# EAGLE design mediator (EAGLE 5.11)
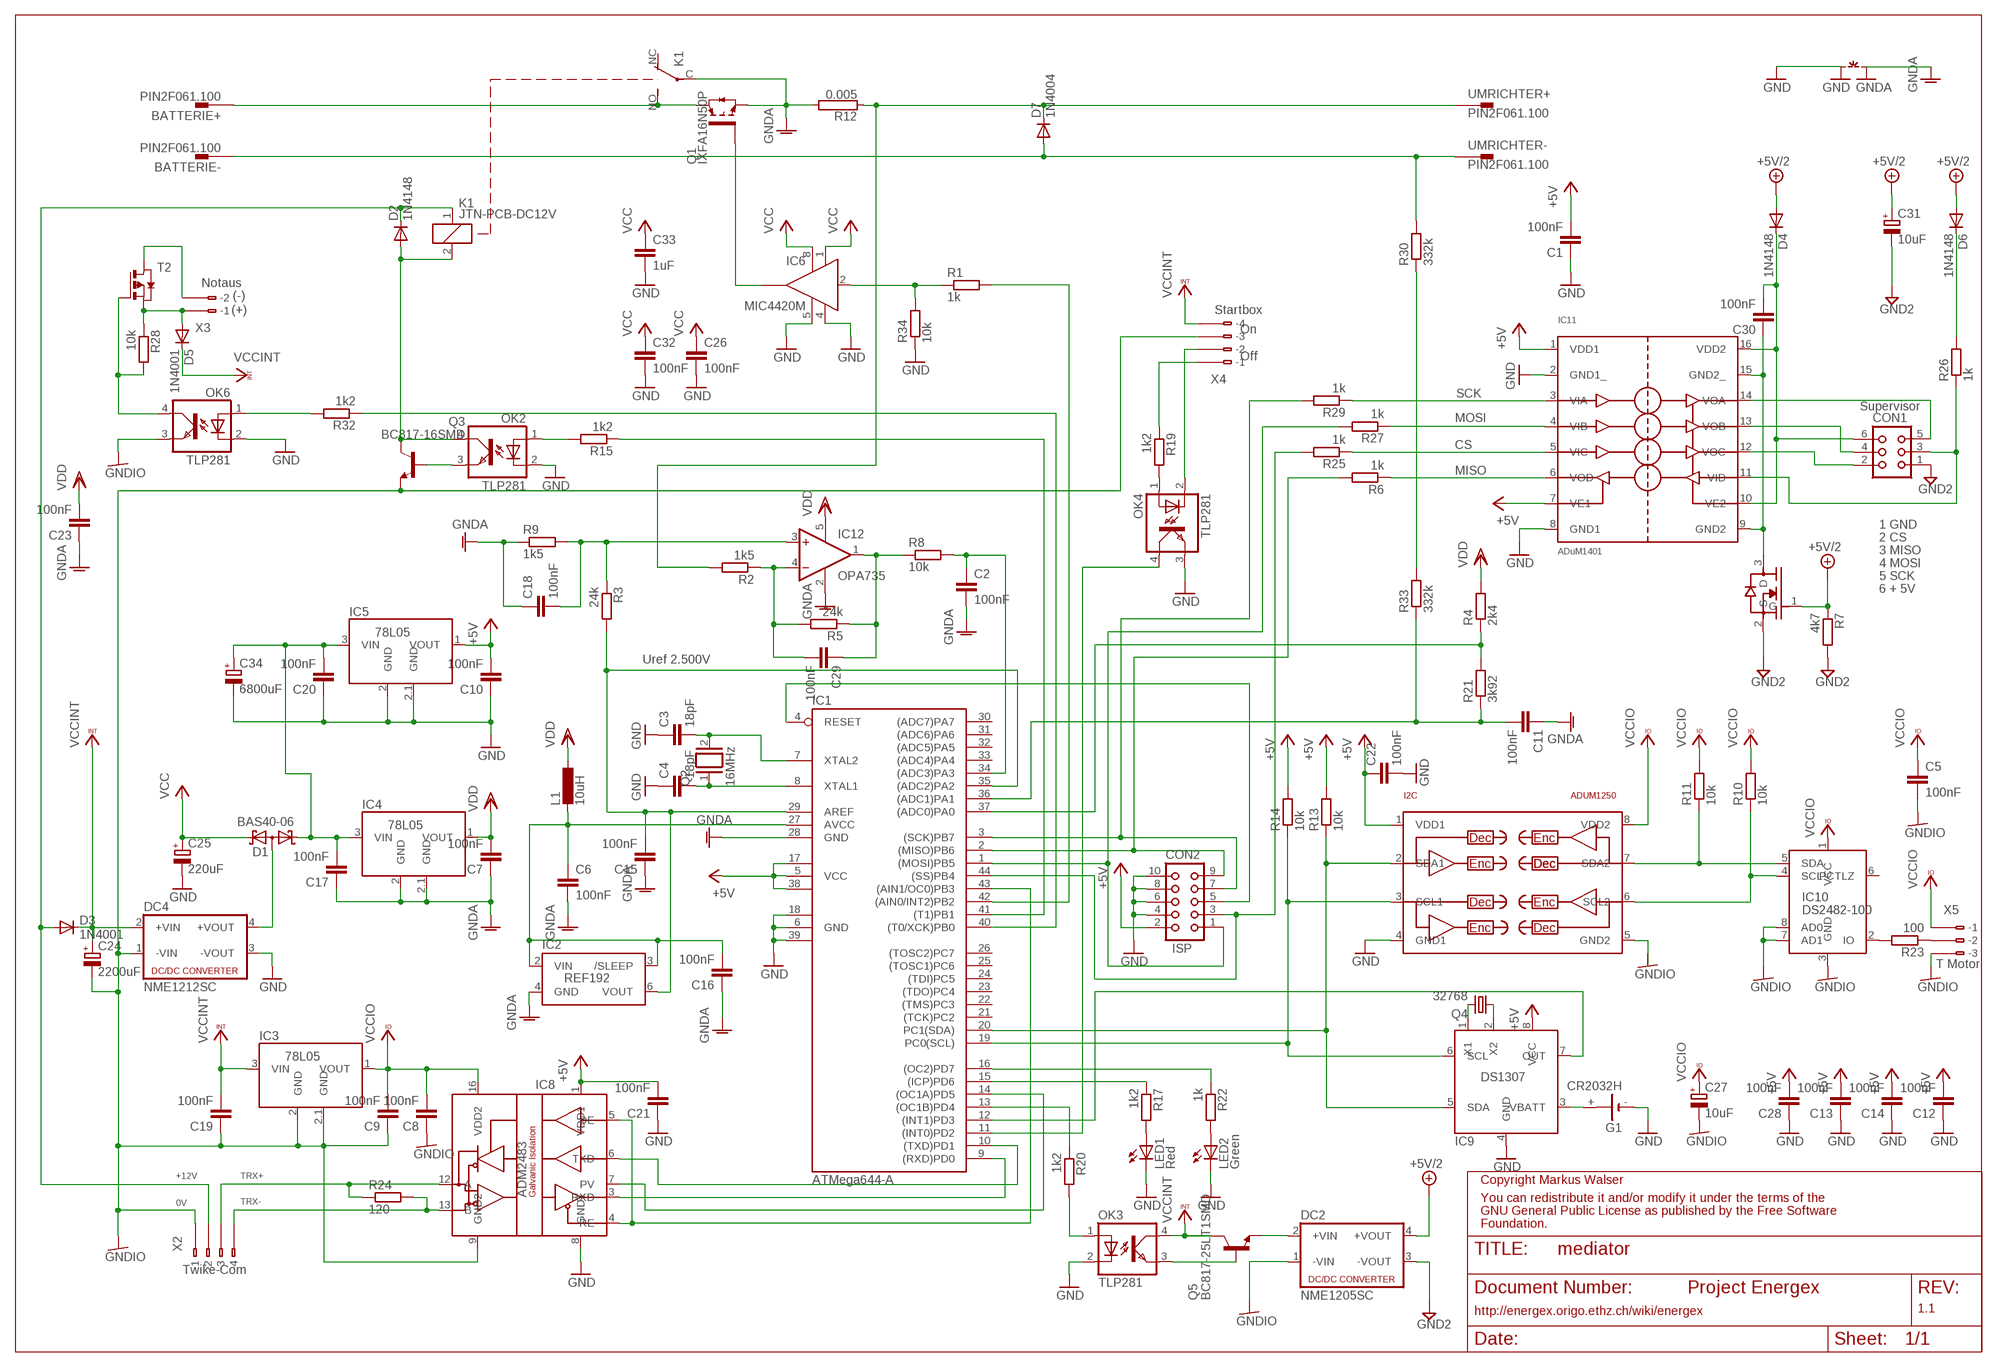
[diagram p0: schematic, sheet 1]

## Parts
BATTERIE+  PIN2F061.100  [F061.100]
BATTERIE-  PIN2F061.100  [F061.100]
C1  100nF  C-EUC0603K  [C0603K]
C2  100nF  C-EUC0603K  [C0603K]
C3  18pF  C-EUC0603K  [C0603K]
C4  18pF  C-EUC0603K  [C0603K]
C5  100nF  C-EUC0603K  [C0603K]
C6  100nF  C-EUC0603K  [C0603K]
C7  100nF  C-EUC0603K  [C0603K]
C8  100nF  C-EUC0603K  [C0603K]
C9  100nF  C-EUC0603K  [C0603K]
C10  100nF  C-EUC0603K  [C0603K]
C11  100nF  C-EUC0603K  [C0603K]
C12  100nF  C-EUC0603K  [C0603K]
C13  100nF  C-EUC0603K  [C0603K]
C14  100nF  C-EUC0603K  [C0603K]
C15  100nF  C-EUC0603K  [C0603K]
C16  100nF  C-EUC0603K  [C0603K]
C17  100nF  C-EUC0603K  [C0603K]
C18  100nF  C-EUC0603K  [C0603K]
C19  100nF  C-EUC0603K  [C0603K]
C20  100nF  C-EUC0603K  [C0603K]
C21  100nF  C-EUC0603K  [C0603K]
C22  100nF  C-EUC0603K  [C0603K]
C23  100nF  C-EUC0603K  [C0603K]
C24  2200uF  CPOL-EUE5-10.5  [E5-10,5]
C25  220uF  CPOL-EUE2.5-6  [E2,5-6]
C26  100nF  C-EUC0603K  [C0603K]
C27  10uF  CPOL-EUSMCA  [SMC_A]
C28  100nF  C-EUC0603K  [C0603K]
C29  100nF  C-EUC0603K  [C0603K]
C30  100nF  C-EUC0603K  [C0603K]
C31  10uF  CPOL-EUSMCA  [SMC_A]
C32  100nF  C-EUC0603K  [C0603K]
C33  1uF  C-EUC0603K  [C0603K]
C34  6800uF  CPOL-EUE7.5-16  [E7,5-16]
CON1  CON06  [CON06]
CON2  CON10  [CON10]
D1  BAS40-06  [SOT23]
D2  1N4148  DIODE-MICROMELF-R  [MICROMELF-R]
D3  1N4001  DIODE-DO214AC  [DO214AC]
D4  1N4148  DIODE-MICROMELF-R  [MICROMELF-R]
D5  1N4001  DIODE-DO214AC  [DO214AC]
D6  1N4148  DIODE-MICROMELF-R  [MICROMELF-R]
D7  1N4004  [DO41-10]
DC2  NME1205SC  NME  [NME]
DC4  NME1212SC  NME  [NME]
G1  CR2032H  [CR2032H]
I2C  ADUM1250  [SO8]
IC1  ATMega644-A  MEGA32-A  [TQFP44]
IC2  REF192  [SO08]
IC3  78L05  [SOT89]
IC4  78L05  [SOT89]
IC5  78L05  [SOT89]
IC6  MIC4420M  [SO-08]
IC8  ADM2483  [SO16W]
IC9  DS1307  [SO08]
IC10  DS2482-100  [SO08]
IC11  ADuM1401  ADUM1401  [SO16W]
IC12  OPA735  OPA743  [SOT23-5]
K1  JTN-PCB-DC12V  [JT-PCB]
L1  10uH  L-EUL3225M  [L3225M]
LED1  Red  LEDCHIPLED_0805  [CHIPLED_0805]
LED2  Green  LEDCHIPLED_0805  [CHIPLED_0805]
OK2  TLP281  TLP283  [MINI-FLAT-4]
OK3  TLP281  TLP283  [MINI-FLAT-4]
OK4  TLP281  TLP283  [MINI-FLAT-4]
OK6  TLP281  TLP283  [MINI-FLAT-4]
Q1  IXFA16N50P  IRG4BC15UD-S  [D2PACK]
Q2  16MHz  XTAL/S  [QS]
Q3  BC817-16SMD  [SOT23-BEC]
Q4  32768  CRYSTALTC26H  [TC26H]
Q5  BC817-25LT1SMD  [SOT23-BEC]
R1  1k  R-EU_R0603  [R0603]
R2  1k5  R-EU_M0805  [M0805]
R3  24k  R-EU_M0805  [M0805]
R4  2k4  R-EU_M0805  [M0805]
R5  24k  R-EU_M0805  [M0805]
R6  1k  R-EU_M0805  [M0805]
R7  4k7  R-EU_R0603  [R0603]
R8  10k  R-EU_M0805  [M0805]
R9  1k5  R-EU_M0805  [M0805]
R10  10k  R-EU_M0805  [M0805]
R11  10k  R-EU_M0805  [M0805]
R12  0.005  RKH208-8  [KH208-8]
R13  10k  R-EU_M0805  [M0805]
R14  10k  R-EU_M0805  [M0805]
R15  1k2  R-EU_R0603  [R0603]
R17  1k2  R-EU_R0603  [R0603]
R19  1k2  R-EU_R0603  [R0603]
R20  1k2  R-EU_R0603  [R0603]
R21  3k92  R-EU_M0805  [M0805]
R22  1k  R-EU_R0603  [R0603]
R23  100  R-EU_M0805  [M0805]
R24  120  R-EU_R0603  [R0603]
R25  1k  R-EU_M0805  [M0805]
R26  1k  R-EU_R0603  [R0603]
R27  1k  R-EU_M0805  [M0805]
R28  10k  R-EU_M0805  [M0805]
R29  1k  R-EU_M0805  [M0805]
R30  332k  R-EU_0207/10  [0207/10]
R32  1k2  R-EU_R0603  [R0603]
R33  332k  R-EU_0207/5V  [0207/5V]
R34  10k  R-EU_R0603  [R0603]
T1  FDN337N  [SOT23]
T2  PMOSSOT23  [SOT-23]
UMRICHTER+  PIN2F061.100  [F061.100]
UMRICHTER-  PIN2F061.100  [F061.100]
X2  233-104  [233-104]
X3  233-102  [233-102]
X4  233-104  [233-104]
X5  233-203  [233-203]
~NUDEV~1  GND-GNDA  [GND-GNDA]

## Nets
+5V: C1.2 C10.2 C12.2 C13.2 C14.2 C21.2 C22.1 C28.2 CON2.2 I2C.1(VDD1) IC1.5(VCC) IC1.17(VCC1) IC1.38(VCC2) IC5.1(VOUT) IC8.1(VDD1) IC9.8(VCC) IC11.1(VDD1) IC11.7(VE1) R13.2 R14.2
+5V/2: C31.+ D4.A D6.A DC2.4(+VOUT) R7.1 T1.1(G)
GND: C1.1 C3.1 C4.1 C10.1 C12.1 C13.1 C14.1 C20.1 C21.1 C22.2 C25.- C26.2 C28.1 C32.2 C33.2 C34.- CON2.4 CON2.6 CON2.8 CON2.10 DC4.3(-VOUT) G1.- I2C.4(GND1) IC1.6(GND) IC1.18(GND1) IC1.39(GND2) IC5.2(GND) IC5.2.1(GND) IC6.4(GND) IC6.5(GND1) IC8.8(GND1) IC9.4(GND) IC11.2(GND1_) IC11.8(GND1) LED1.C LED2.C OK2.2(C) OK3.2(C) OK4.3(EMIT) OK6.2(C) R34.1 ~NUDEV~1.GND
GND2: C31.- CON1.1 DC2.3(-VOUT) R7.2 T1.2(S)
GNDA: C2.2 C6.2 C7.1 C11.1 C15.1 C16.1 C17.1 C18.1 C23.1 IC1.28(GND) IC2.4(GND) IC4.2(GND) IC4.2.1(GND) IC12.2(V-) K1.C(P) Q1.3(E) R9.1 R12.2 ~NUDEV~1.GNDA
GNDIO: C5.2 C8.1 C9.1 C19.1 C24.- C27.- DC2.1(-VIN) DC4.1(-VIN) I2C.5(GND2) IC3.2(GND) IC3.2.1(GND) IC8.9(GND2) IC10.3(GND) IC10.7(AD1) IC10.8(AD0) OK6.3(EMIT) Q3.E X2.B1(B-1) X4.B3(B-3) X5.B3(B-3)
N$1: IC6.6(OUT) Q1.1(G)
N$2: BATTERIE+.A1 K1.NO(S) Q1.2(C)
N$3: IC9.1(X1) Q4.2
N$4: CON2.7 IC1.3((SCK)PB7) R29.2
N$5: C18.2 IC12.3(+IN) R3.1 R9.2
N$6: C29.2 IC12.4(-IN) R2.1 R5.2
N$7: C29.1 IC12.1(OUT) R5.1 R8.1
N$8: CON2.1 IC1.1((MOSI)PB5) R27.2
N$9: DC2.2(+VIN) Q5.E
N$10: CON2.3 IC1.44((SS)PB4) R25.2
N$11: C2.1 IC1.34((ADC3)PA3) R8.2
N$12: C3.2 IC1.7(XTAL2) Q2.2
N$13: C4.2 IC1.8(XTAL1) Q2.1
N$14: I2C.6(SCL2) IC10.4(SCL) R10.1
N$15: I2C.7(SDA2) IC10.5(SDA) R11.1
N$16: D7.C R2.2 R12.1 UMRICHTER+.A1
N$17: IC10.2(IO) R23.2
N$18: BATTERIE-.A1 D7.A R30.2 UMRICHTER-.A1
N$19: IC1.37((ADC0)PA0) R4.1 R21.2
N$20: OK2.3(EMIT) Q3.B
N$21: OK2.1(A) R15.2
N$22: C6.1 C16.2 IC1.27(AVCC) IC2.2(VIN) IC2.3(/SLEEP) L1.2
N$23: I2C.2(SDA1) IC1.20(PC1(SDA)) IC9.5(SDA) R13.1
N$24: I2C.3(SCL1) IC1.19(PC0(SCL)) IC9.6(SCL) R14.1
N$25: IC1.41((T1)PB1) R15.1
N$26: D2.C D3.A K1.1 X2.B2(B-2)
N$27: IC1.15((ICP)PD6) R17.1
N$28: D2.A K1.2 OK2.4(COL) Q3.C
N$29: IC1.9((RXD)PD0) IC8.3(RXD)
N$30: CON2.9 IC1.2((MISO)PB6) R6.2
N$31: IC1.42((AIN0/INT2)PB2) R1.2
N$32: IC11.6(VOD) R6.1
N$33: D5.A R28.1 T2.2(S) X3.B1(B-1)
N$34: IC1.10((TXD)PD1) IC8.6(TXD)
N$35: CON1.2 IC11.12(VOC)
N$36: IC8.13(B) R24.2 X2.B4(B-4)
N$37: IC1.16((OC2)PD7) R22.1
N$38: IC8.12(A) R24.1 X2.B3(B-3)
N$39: IC1.43((AIN1/OC0)PB3) IC8.4(RE) IC8.5(DE)
N$40: IC1.14((OC1A)PD5) IC8.7(PV)
N$41: R23.1 X5.B2(B-2)
N$42: R30.1 R33.2
N$43: T2.1(D) X3.B2(B-2)
N$44: C30.1 IC11.9(GND2) IC11.15(GND2_) T1.3(D)
N$45: OK3.3(EMIT) Q5.B
N$46: OK3.1(A) R20.2
N$47: IC1.13((OC1B)PD4) R20.1
N$48: IC1.11((INT0)PD2) OK4.4(COL)
N$49: OK4.2(C) X4.B2(B-2)
N$50: OK4.1(A) R19.2
N$51: G1.+ IC9.3(VBATT)
N$52: CON1.3 IC11.11(VID) R26.1
N$53: CON1.4 IC11.13(VOB)
N$54: CON2.5 IC1.4(RESET)
N$55: CON1.5 IC11.14(VOA)
N$57: LED1.A R17.2
N$58: R19.1 X4.B1(B-1)
N$59: C15.2 IC1.29(AREF) IC1.35((ADC2)PA2) IC2.6(VOUT) R3.2
N$60: IC1.12((INT1)PD3) IC9.7(OUT)
N$61: C30.2 CON1.6 D4.C IC11.10(VE2) IC11.16(VDD2)
N$62: C17.2 C20.2 C34.+ D1.1(K1) IC4.3(VIN) IC5.3(VIN)
N$63: IC9.2(X2) Q4.1
N$64: LED2.A R22.2
N$65: IC6.2(IN) R1.1 R34.2
N$66: D1.3(AA) DC4.4(+VOUT)
N$67: C11.2 IC1.36((ADC1)PA1) R21.1 R33.1
N$69: D6.C R26.2
N$70: IC11.5(VIC) R25.1
N$71: IC11.4(VIB) R27.1
N$72: IC11.3(VIA) R29.1
N$73: OK6.4(COL) R28.2 T2.3(G)
N$74: OK6.1(A) R32.2
N$76: IC1.40((T0/XCK)PB0) R32.1
VCC: C25.+ C26.1 C32.1 C33.1 D1.2(K2) IC6.1(VS) IC6.8(VS1)
VCCINT: C19.2 C24.+ D3.C D5.C DC4.2(+VIN) IC3.3(VIN) OK3.4(COL) Q5.C X4.B4(B-4)
VCCIO: C5.1 C8.2 C9.2 C27.+ I2C.8(VDD2) IC3.1(VOUT) IC8.16(VDD2) IC10.1(VCC) R10.2 R11.2 X5.B1(B-1)
VDD: C7.2 C23.2 IC4.1(VOUT) IC12.5(V+) L1.1 R4.2
Unconnected: BATTERIE+.A2(1.1) BATTERIE-.A2(1.1) G1.+@1(+) IC1.21((TCK)PC2) IC1.22((TMS)PC3) IC1.23((TDO)PC4) IC1.24((TDI)PC5) IC1.25((TOSC1)PC6) IC1.26((TOSC2)PC7) IC1.30((ADC7)PA7) IC1.31((ADC6)PA6) IC1.32((ADC5)PA5) IC1.33((ADC4)PA4) IC6.7(OUT) IC10.6(PCTLZ) K1.NC(O) UMRICHTER+.A2(1.1) UMRICHTER-.A2(1.1) X2.A1(-1) X2.A2(-2) X2.A3(-3) X2.A4(-4) X3.A1(-1) X3.A2(-2) X4.A1(-1) X4.A2(-2) X4.A3(-3) X4.A4(-4) X5.A1(-1) X5.A2(-2) X5.A3(-3)

## Notes on the sheet
- Notaus
- (-)
- (+) | Startbox
- On
- Off
- SCK
- Supervisor
- MOSI
- CS
- MISO
- 1 GND
- 2 CS
- 3 MISO
- 4 MOSI
- 5 SCK
- 6 + 5V
- Uref 2.500V
- ISP
- T Motor
- +12V | TRX+
- Copyright Markus Walser
- TRX- | You can redistribute it and/or modify it under the terms of the
- 0V
- GNU General Public License as published by the Free Software
- Foundation.
- Twike-Com
- Project Energex
- http://energex.origo.ethz.ch/wiki/energex | 1.1

## Library data of the parts
BATTERIE+ BATTERIE- UMRICHTER+ UMRICHTER- = con-faston:PIN2: Flachstecker Typ Tyco/Electronics/AMP TAB, FASTON Printed Circuit Board Tabs Source: http://www.buerklin.com, http://catalog.tycoelectronics.com; OC_FARNELL: unknown; OC_NEWARK: unknown
C1-C23 C26 C28-C30 C32 C33 = rcl:C-EU: CAPACITOR, European symbol
C24 C25 C27 C31 C34 = rcl:CPOL-EU: POLARIZED CAPACITOR, European symbol
CON1 = con-harting:CON06: CONNECTOR; OC_FARNELL: unknown; OC_NEWARK: unknown
CON2 = con-harting:CON10: CONNECTOR; OC_FARNELL: unknown; OC_NEWARK: unknown
D1 = diode:BAS40-06: Silicon Schottky Diodes General-purpose diode for high-speed switching
D2-D6 = diode:DIODE-: DIODE
D7 = diode:1N4004: DIODE general purpose rectifier, 1 A
DC2 DC4 = dc-dc-converter:NME: DC-DC CONVERTER; MF: C & D TECHNOLOGIES, INC; MPN: NME1205D; OC_FARNELL: 1021466; OC_NEWARK: 98B8198
G1 = mediator:CR2032H: LI BATTERY Varta
I2C = analog-devices:ADUM1250
IC1 = atmel:MEGA32: MICROCONTROLLER 32 Kbytes FLASH 2 Kbytes SRAM 1 Kbytes EEPROM USART 8-channel 10 bit ADC Source: www.atmel.com .. doc2503.pdf; MPN: ATMEGA32-16AU; OC_FARNELL: 9171274; OC_NEWARK: 69K6677
IC2 = icontroller:REF192
IC3-IC5 = icontroller:78L05: Negative voltage regulators
IC6 = transistor-power:MIC4420: 6A-Peak Low-Side MOSFET Driver Bipolar/CMOS/DMOS Process http://www.micrel.com/_PDF/mic4420.pdf
IC8 = icontroller:ADM2483: RS-485 Transceiver, iCoupler® Isolated, Half-Duplex
IC9 = icontroller:DS1307: 64 x 8, Serial, I2C Real-Time Clock
IC10 = icontroller:DS2482-100: Single-Channel 1-Wire Master
IC11 = spisolator:ADUM1401: Quad-Channel Digital Isolators The ADuM1401 is a 3/1 quad-channel digital isolators based on Analog Devices, Inc., iCoupler® technology. Combining high speed CMOS and monolithic air core transformer technology, these isolation components provide outstanding performance characteristics superior to alternatives, such as optocoupler devices.
IC12 = linear:OPA743: 12V, 7MHz, CMOS, Rail-to-Rail I/O OP AMP Source: http://focus.ti.com/lit/ds/sbos201/sbos201.pdf
K1 = relay:JT?-*: COMPACT ECONOMICAL 30 AMP. RELAY NAiS Source: http://www.mew-europe.com/.. en_ds_61212_0000.pdf; OC_FARNELL: unknown; OC_NEWARK: unknown
L1 = rcl:L-EU: INDUCTOR, European symbol
LED1 LED2 = led:LED: LED OSRAM: - CHIPLED LG R971, LG N971, LY N971, LG Q971, LY Q971, LO R971, LY R971 LH N974, LH R974 LS Q976, LO Q976, LY Q976 LO Q996 - Hyper CHIPLED LW Q18S LB Q993, LB Q99A, LB R99A - SideLED LS A670, LO A670, LY A670, LG A670, LP A670 LB A673, LV A673, LT A673, LW A673 LH A674 LY A675 LS A676, LA A676, LO A676, LY A676, LW A676 LS A679, LY A679, LG A679 - Hyper Micro SIDELED® LS Y876, LA Y876, LO Y876, LY Y876 LT Y87S - SmartLED LW L88C, LW L88S LB L89C, LB L89S, LG L890 LS L89K, LO L89K, LY L89K LS L896, LA L896, LO L896, LY L896 - TOPLED LS T670, LO T670, LY T670, LG T670, LP T670 LSG T670, LSP T670, LSY T670, LOP T670, LYG T670 LG T671, LOG T671, LSG T671 LB T673, LV T673, LT T673, LW T673 LH T674 LS T676, LA T676, LO T676, LY T676, LB T676, LH T676, LSB T676, LW T676 LB T67C, LV T67C, LT T67C, LS T67K, LO T67K, LY T67K, LW E67C LS E67B, LA E67B, LO E67B, LY E67B, LB E67C, LV E67C, LT E67C LW T67C LS T679, LY T679, LG T679 LS T770, LO T770, LY T770, LG T770, LP T770 LB T773, LV T773, LT T773, LW T773 LH T774 LS E675, LA E675, LY E675, LS T675 LS T776, LA T776, LO T776, LY T776, LB T776 LHGB T686 LT T68C, LB T68C - Hyper Mini TOPLED® LB M676 - Mini TOPLED Santana® LG M470 LS M47K, LO M47K, LY M47K Source: http://www.osram.convergy.de LUXEON: - LUMILED® LXK2-PW12-R00, LXK2-PW12-S00, LXK2-PW14-U00, LXK2-PW14-V00 LXK2-PM12-R00, LXK2-PM12-S00, LXK2-PM14-U00 LXK2-PE12-Q00, LXK2-PE12-R00, LXK2-PE12-S00, LXK2-PE14-T00, LXK2-PE14-U00 LXK2-PB12-K00, LXK2-PB12-L00, LXK2-PB12-M00, LXK2-PB14-N00, LXK2-PB14-P00, LXK2-PB14-Q00 LXK2-PR12-L00, LXK2-PR12-M00, LXK2-PR14-Q00, LXK2-PR14-R00 LXK2-PD12-Q00, LXK2-PD12-R00, LXK2-PD12-S00 LXK2-PH12-R00, LXK2-PH12-S00 LXK2-PL12-P00, LXK2-PL12-Q00, LXK2-PL12-R00 Source: www.luxeon.com KINGBRIGHT: KA-3528ASYC Source: www.kingbright.com
OK2-OK4 OK6 = optocoupler:TLP283: TOSHIBA PHOTOCOUPLER GaAs IRED & PHOTO-TRANSISTOR Source: http://www.semicon.toshiba.co.jp/td/en/Opto/Photocoupler/en_20050928_TLP283_datasheet.pdf; OC_FARNELL: unknown; OC_NEWARK: unknown
Q1 = transistor-power:IRG4BC15UD-: INSULATED GATE BIPOLAR TRANSISTOR WITH ULTRAFAST SOFT RECOVERY DIODE
Q2 = special:XTAL/S: CRYSTAL
Q3 Q5 = transistor-npn:BC817*: NPN Transistor
Q4 = crystal:CRYSTAL: CRYSTAL; OC_FARNELL: unknown; OC_NEWARK: unknown
R1-R11 R13-R15 R17 R19-R30 R32-R34 = rcl:R-EU_: RESISTOR, European symbol
R12 = resistor-power:R: Power Resitor; OC_FARNELL: unknown; OC_NEWARK: unknown
T1 = supervisor:FDN337N: N-Channel Logic Level Enhancement Mode Field Effect Transistor
T2 = zetex:PMOSSOT23: MOS FET; OC_FARNELL: unknown; OC_NEWARK: unknown
X2 X4 = con-wago:233-104: WAGO Cage Clamp; MPN: 233-104; OC_FARNELL: unknown; OC_NEWARK: 28K9046
X3 = con-wago:233-102: WAGO Cage Clamp; MPN: 233-102; OC_FARNELL: unknown; OC_NEWARK: 28K9044
X5 = con-wago:233-203: WAGO Cage Clamp; MPN: 233-203; OC_FARNELL: 1283533; OC_NEWARK: 28K9060
~NUDEV~1 = supply1:GND-GNDA: Example of GND--GNDA NET-Connetor for more info see description in package

## Board
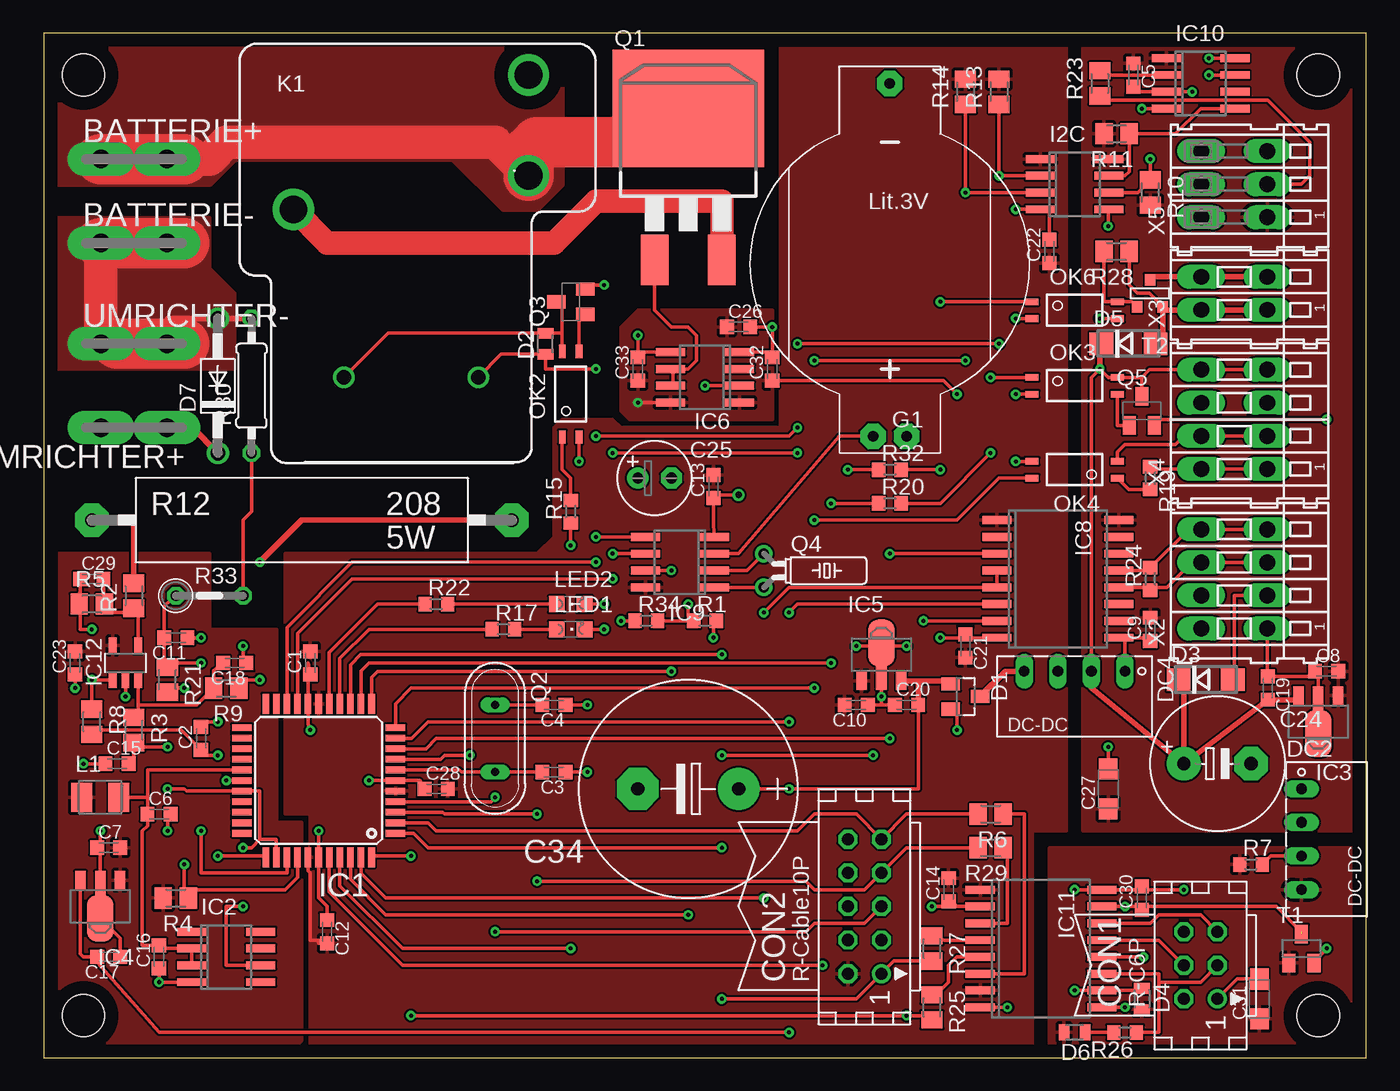
[diagram p1: board, top side]
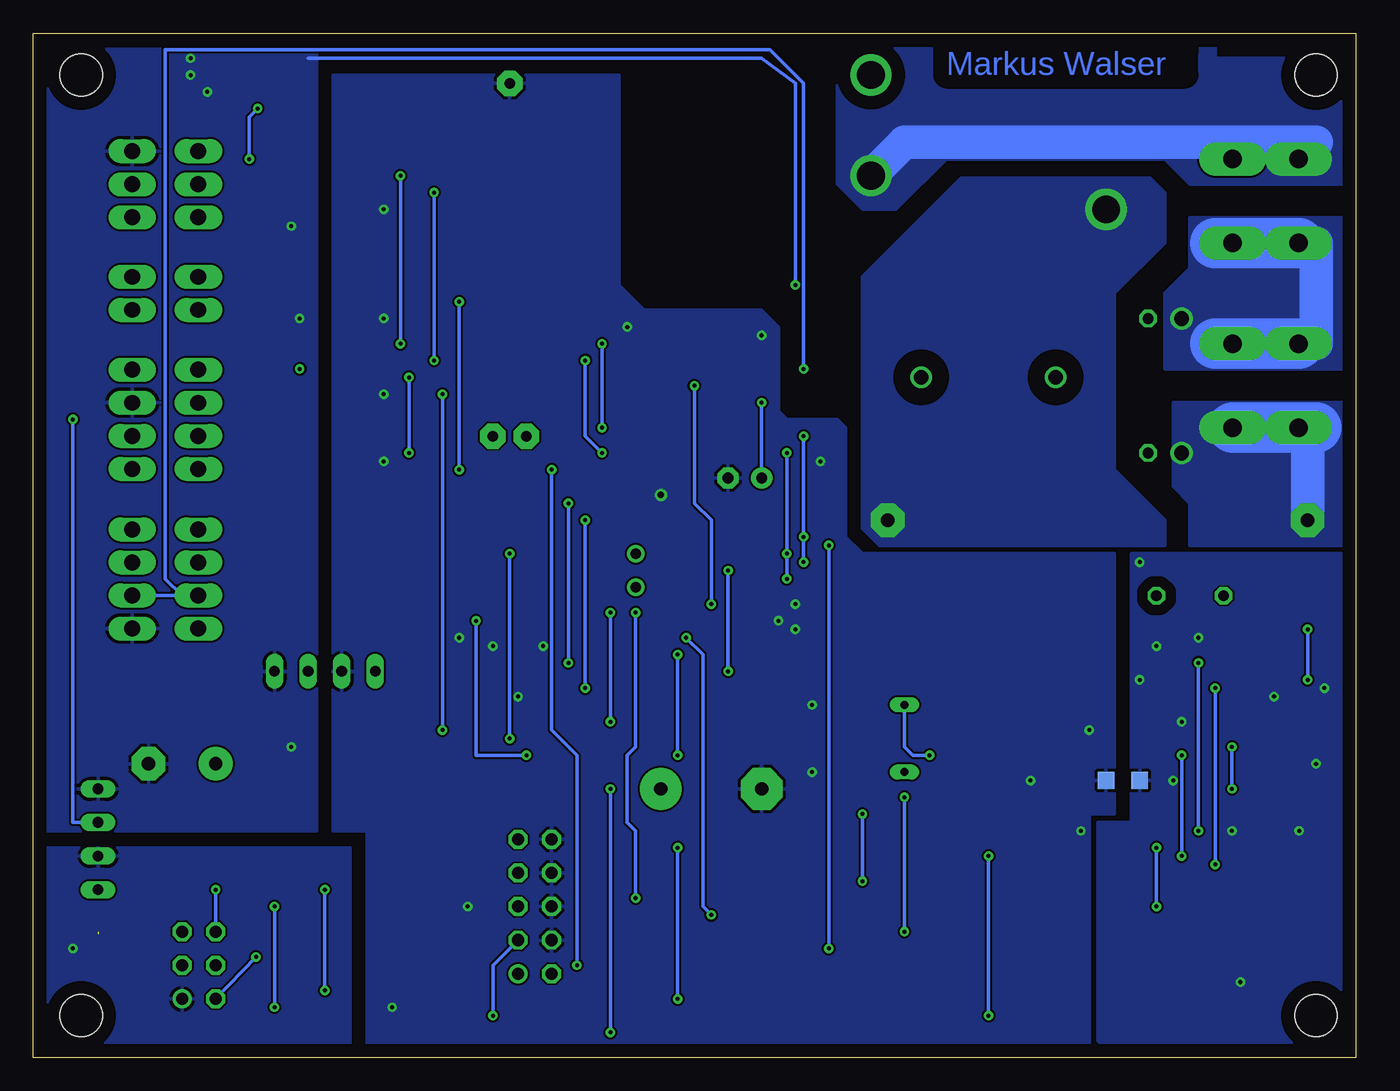
[diagram p2: board, bottom side, seen from below]

Size 100 x 77.46 mm. Coordinates in mm from the lower left corner, seen from the top.
Outline: 0,0 100,0 100,77.46 0,77.46 0,0
Copper layers (1*16): Top 0.035mm / dielectric 1.5mm / Bottom 0.035mm
Design rules "default *": minimum track width 6mil, minimum drill 12mil, track to track 6mil, track to pad 6mil, pad to pad 6mil, via to via 6mil, smd to smd 6mil, copper to edge 40mil, drill to drill 8mil, minimum pad ring 10mil, minimum via ring 8mil, stop-mask expansion 4mil, vias tented up to drill 25mil, thermal gap 10mil
Holes 3.2 mm at 96.36,3.17 3.01,3.17 96.36,74.29 3.01,74.29

### Footprints (pad centres in the part's own frame; a part is rotated, then mirrored left to right if it is on the bottom)
F061.100 = drill 1.4 pad 2.54 long: A1 -2.5,0; A2 2.5,0
C0603K = smd 1.05 x 1.08: 1 -0.875,0; 2 0.875,0
E5-10,5 = drill 1.016 pad 2.54: + -2.54,0 | drill 1.016 pad 2.54 octagon: - 2.54,0
E2,5-6 = drill 0.813 pad 1.6: + -1.27,0 | drill 0.813 pad 1.6 octagon: - 1.27,0
SMC_A = smd 1.6 x 1.4: + -1.5,0; - 1.5,0
E7,5-16 = drill 1.016 pad 3.15: + -3.81,0 | drill 1.016 pad 3.15 octagon: - 3.81,0
CON06 = drill 0.914: 1 -2.54,-1.27 | drill 0.914 octagon: 2 -2.54,1.27; 3 0,-1.27; 4 0,1.27; 5 2.54,-1.27; 6 2.54,1.27
CON10 = drill 0.914: 1 -5.08,-1.27 | drill 0.914 octagon: 2 -5.08,1.27; 3 -2.54,-1.27; 4 -2.54,1.27; 5 0,-1.27; 6 0,1.27; 7 2.54,-1.27; 8 2.54,1.27; 9 5.08,-1.27; 10 5.08,1.27
SOT23 = smd 1 x 1.4: 1 -0.95,-1.1; 2 0.95,-1.1; 3 0,1.1
MICROMELF-R = smd 0.8 x 1.2: A 0.8,0; C -0.8,0
DO214AC = smd 1.8 x 1.7: A 2.05,0; C -2.05,0
DO41-10 = drill 1.118: A 5.08,0; C -5.08,0
NME = drill 0.813 long: 1 0,3.81; 2 0,1.27; 3 0,-1.27; 4 0,-3.81
CR2032H = drill 0.8 pad 1.93 octagon: + 1.27,13.335; +@1 -1.27,13.335; - 0,-13.335
SO8@1 = smd 0.6 x 2.2: 1 -1.905,-2.6; 2 -0.635,-2.6; 3 0.635,-2.6; 4 1.905,-2.6; 5 1.905,2.6; 6 0.635,2.6; 7 -0.635,2.6; 8 -1.905,2.6
TQFP44 = smd 1.5 x 0.5: 1 -5.8,4; 2 -5.8,3.2; 3 -5.8,2.4; 4 -5.8,1.6; 5 -5.8,0.8; 6 -5.8,0; 7 -5.8,-0.8; 8 -5.8,-1.6; 9 -5.8,-2.4; 10 -5.8,-3.2; 11 -5.8,-4; 23 5.8,-4; 24 5.8,-3.2; 25 5.8,-2.4; 26 5.8,-1.6; 27 5.8,-0.8; 28 5.8,0; 29 5.8,0.8; 30 5.8,1.6; 31 5.8,2.4; 32 5.8,3.2; 33 5.8,4 | smd 0.5 x 1.5: 12 -4,-5.8; 13 -3.2,-5.8; 14 -2.4,-5.8; 15 -1.6,-5.8; 16 -0.8,-5.8; 17 0,-5.8; 18 0.8,-5.8; 19 1.6,-5.8; 20 2.4,-5.8; 21 3.2,-5.8; 22 4,-5.8; 34 4,5.8; 35 3.2,5.8; 36 2.4,5.8; 37 1.6,5.8; 38 0.8,5.8; 39 0,5.8; 40 -0.8,5.8; 41 -1.6,5.8; 42 -2.4,5.8; 43 -3.2,5.8; 44 -4,5.8
SO08 = smd 0.6 x 2.2: 1 -1.905,-2.6; 2 -0.635,-2.6; 3 0.635,-2.6; 4 1.905,-2.6; 5 1.905,2.6; 6 0.635,2.6; 7 -0.635,2.6; 8 -1.905,2.6
SOT89 = smd 0.8 x 1.4: 1 -1.499,-1.981; 3 1.499,-1.981 | smd 0.8 x 1.9: 2 0,-1.727 | smd 2 x 3.5: 2.1 0,0.889
SO-08 = smd 0.6 x 2.2: 1 -1.905,-2.6; 2 -0.635,-2.6; 3 0.635,-2.6; 4 1.905,-2.6; 5 1.905,2.6; 6 0.635,2.6; 7 -0.635,2.6; 8 -1.905,2.6
SO16W = smd 0.6 x 2.2: 1 -4.445,-4.6; 2 -3.175,-4.6; 3 -1.905,-4.6; 4 -0.635,-4.6; 5 0.635,-4.6; 6 1.905,-4.6; 7 3.175,-4.6; 8 4.445,-4.6; 9 4.445,4.6; 10 3.175,4.6; 11 1.905,4.6; 12 0.635,4.6; 13 -0.635,4.6; 14 -1.905,4.6; 15 -3.175,4.6; 16 -4.445,4.6
SOT23-5 = smd 0.6 x 1.2: 1 -0.95,-1.306; 2 0,-1.306; 3 0.95,-1.306; 4 0.95,1.306; 5 -0.95,1.306
JT-PCB = drill 1.1: 1 5.08,0; 2 -5.08,0 | drill 2.1: C -8.89,12.7; NC 8.89,22.86; NO 8.89,15.24
L3225M = smd 1.6 x 2.2: 1 -1.4,0; 2 1.4,0
CHIPLED_0805 = smd 1.2 x 1.2: A 0,-1.05; C 0,1.05
MINI-FLAT-4 = smd 1 x 0.5: 1 -3.24,0.635; 2 -3.24,-0.635; 3 3.24,-0.635; 4 3.24,0.635
D2PACK = smd 2.083 x 3.81: 1 -2.54,-8.89; 3 2.54,-8.89 | smd 11.43 x 8.89: 2 0,2.54
QS = drill 0.61 long: 1 -2.54,0; 2 2.54,0
SOT23-BEC = smd 1 x 1.4: B -0.95,-1.1; C 0,1.1; E 0.95,-1.1
TC26H = drill 0.813: 1 -1.27,0; 2 1.27,0
R0603 = smd 1 x 1.1: 1 -0.85,0; 2 0.85,0
M0805 = smd 1.3 x 1.6: 1 -0.95,0; 2 0.95,0
KH208-8 = drill 1.016 pad 2.54 octagon: 1 -15.875,0; 2 15.875,0
0207/10 = drill 0.813 octagon: 1 -5.08,0; 2 5.08,0
0207/5V = drill 0.813 octagon: 1 -2.54,0; 2 2.54,0
SOT-23 = smd 0.787 x 0.889: 1 0.025,-1.016; 2 -0.94,1.016; 3 0.991,1.016
233-104 = drill 1.2 long: A1 -3.75,2.5; A2 -1.25,2.5; A3 1.25,2.5; A4 3.75,2.5; B1 -3.75,-2.5; B2 -1.25,-2.5; B3 1.25,-2.5; B4 3.75,-2.5
233-102 = drill 1.2 long: A1 -1.25,2.5; A2 1.25,2.5; B1 -1.25,-2.5; B2 1.25,-2.5
233-203 = drill 1.2 long: A1 -2.5,2.5; A2 0,2.5; A3 2.5,2.5; B1 -2.5,-2.5; B2 0,-2.5; B3 2.5,-2.5
GND-GNDA = smd 1.27 x 1.27: GND -1.27,0; GNDA 1.27,0

### Placement (x,y rotation side)
BATTERIE+  6.82,67.94 0 top
BATTERIE-  6.82,61.59 0 top
C1  20.15,29.84 90 top
C2  11.9,24.12 90 top
C3  38.57,21.58 180 top
C4  38.57,26.66 180 top
C5  82.39,74.29 270 top
C6  8.73,18.41 0 top
C7  4.92,15.87 0 top
C8  96.99,29.2 0 top
C9  83.66,32.38 90 top
C10  61.43,26.66 180 top
C11  10,31.74 180 top
C12  21.42,9.52 270 top
C13  50.63,43.18 90 top
C14  68.41,12.7 90 top
C15  5.55,22.22 0 top
C16  8.73,7.62 90 top
C17  4.92,7.62 180 top
C18  14.44,29.84 180 top
C19  92.55,27.93 270 top
C20  65.24,26.66 0 top
C21  69.69,31.11 270 top
C22  76.03,60.96 90 top
C23  2.38,29.84 90 top
C24  88.73,22.22 0 top
C25  46.19,43.81 0 top
C26  52.54,55.24 0 top
C27  80.48,20.31 90 top
C28  29.68,20.31 0 top
C29  3.64,36.19 0 top
C30  83.02,12.06 90 top
C31  91.91,4.44 90 top
C32  55.08,52.07 90 top
C33  44.92,52.07 90 top
C34  48.73,20.31 180 top
CON1  87.47,6.98 90 top
CON2  62.06,11.43 90 top
D1  69.69,27.3 270 top
D2  37.94,53.97 90 top
D3  87.85,28.57 0 top
D4  83.02,4.44 270 top
D5  82,53.97 0 top
D6  77.94,1.9 180 top
D7  13.17,50.8 90 top
DC2  95.08,16.5 0 top
DC4  77.94,29.2 270 top
G1  63.97,60.32 180 top
I2C  ADUM1250  [SO8@1]  77.94,66.03 270 top
IC1  20.79,20.95 180 top
IC2  13.81,7.62 270 top
IC3  96.36,25.39 180 top
IC4  4.28,11.43 180 top
IC5  63.34,30.47 0 top
IC6  50,51.43 90 top
IC8  76.67,36.19 270 top
IC9  48.09,37.46 90 top
IC10  87.47,73.66 270 top
IC11  75.4,8.25 270 top
IC12  6.18,29.84 0 top
K1  27.77,51.43 0 top
L1  4.28,19.68 0 top
LED1  39.84,32.38 270 top
LED2  39.84,34.29 270 top
OK2  39.84,50.16 90 top
OK3  77.94,50.8 0 top
OK4  77.94,44.45 180 top
OK6  77.94,56.51 0 top
Q1  STB25NM50N  [D2PACK]  48.73,69.21 0 top
Q2  34.12,24.12 270 top
Q3  39.84,57.15 90 top
Q4  54.45,36.83 270 top
Q5  83.02,48.89 0 top
R1  50,33.02 0 top
R2  6.82,34.92 90 top
R3  6.82,24.76 270 top
R4  10,12.06 180 top
R5  3.64,34.29 0 top
R6  71.59,18.41 180 top
R7  91.28,14.6 0 top
R8  3.64,25.39 270 top
R9  13.81,27.93 180 top
R10  83.66,65.4 270 top
R11  81.11,69.84 180 top
R12  19.52,40.64 0 top
R13  72.22,73.02 90 top
R14  69.69,73.02 90 top
R15  39.84,41.27 90 top
R17  34.76,32.38 0 top
R19  83.66,43.81 270 top
R20  63.97,41.91 0 top
R21  9.36,28.57 270 top
R22  29.68,34.29 0 top
R23  79.84,73.66 90 top
R24  83.66,36.19 90 top
R25  67.14,3.8 270 top
R26  81.75,1.9 180 top
R27  67.14,8.25 270 top
R28  81.11,60.96 180 top
R29  71.59,15.87 180 top
R30  15.71,50.8 90 top
R32  63.97,44.45 0 top
R33  12.54,34.92 0 top
R34  45.55,33.02 0 top
T1  95.08,8.25 0 top
T2  83.66,57.78 180 top
UMRICHTER+  6.82,47.62 180 top
UMRICHTER-  6.82,53.97 0 top
X2  90,36.19 90 top
X3  90,57.78 90 top
X4  90,48.26 90 top
X5  90,66.03 90 top
~NUDEV~1  17.61,20.95 0 bottom

### Tracks (layer width: path | path; a pad name or v marks a point on that pad's centre or on a via)
+5V
  Top 0.254: C12.2 20.79,8.65 20.79,8.89 20.15,8.89 20.15,13.97 19.99,14.13 IC1.38
  pour Top: 77.3,76.83 55.71,76.83 55.71,47.62 43.65,47.62 43.02,48.26 39.2,48.26 38.57,47.62 38.57,39.37 37.3,38.1 18.25,38.1 18.25,18.41 20.15,18.41 20.15,0.63 74.77,0.63 74.77,17.14 77.3,17.14
+5V/2
  pour Top: 76.03,15.87 99.53,15.87 99.53,1.9 98.26,0.63 76.03,0.63
GND  (via drill 0.3, 0.5)
  Top 0.254: C1.1 19.99,29.84 IC1.18 19.99,25.23 v20.15,24.76 | C28.1 28.41,20.95 IC1.6 v24.6,20.95 | v20.79,17.14 IC1.39 20.79,12.06 21.42,11.43 C12.1 | LED2.C v42.38,34.29 | LED1.C v42.38,32.38 | v40.48,45.08 OK2.2 | v73.5,64.13 I2C.4 76.03,64.07 C22.2 | 74.77,55.81 OK6.2 v73.5,55.88 | 74.77,50.1 OK3.2 v73.5,50.16 | 74.77,45.15 OK4.3 v73.5,45.08 | C21.1 69.92,31.74 IC8.8 v67.78,31.74 | 63.08,31.11 IC5.2.1 IC5.2 v63.34,27.3 63.34,26.66 | 63.08,31.11 v65.24,31.11 | 63.34,26.66 C20.1 | 62.06,26.66 C10.1 63.34,26.66 | 71.59,3.8 IC11.8 v72.86,3.8 | C3.1 v41.11,21.58 | C4.1 v41.11,26.66 | IC9.4 50.63,40.64 C13.1 50.63,42.54 v52.54,42.54 | 63.08,31.11 v61.43,31.11 | 69.05,11.43 v67.14,11.43 | 69.05,11.43 IC11.2 | C14.1 69.05,11.43 | v44.92,54.61 C33.2 arc-90 45.31,53.34 IC6.5 | IC6.4 55.08,53.34 C32.2 v55.08,55.24 C26.2 | R34.1 v43.65,33.02
  pour Bottom: 55.71,74.29 77.3,74.29 77.3,17.14 74.77,17.14 74.77,-0.01 20.15,-0.01 20.15,18.41 18.25,18.41 18.25,38.1 37.3,38.1 38.57,39.37 38.57,47.62 39.2,48.26 43.02,48.26 43.65,48.89 43.65,55.24 44.92,56.51 53.81,56.51 55.71,58.41
GND2  (via drill 0.3)
  Top 0.254: CON1.1 90.23,5.94 C31.- | DC2.3 92.76,15.24 R7.2 | T1.2 v96.99,8.25
  pour Bottom: 76.03,15.87 99.53,15.87 99.53,1.9 98.26,0.63 76.03,0.63
GNDA  (via drill 0.3)
  Top 0.254: 4.28,15.63 IC4.2 IC4.2.1 5.79,9.03 C17.1 | 4.28,15.63 C7.1 | 4.28,15.63 v4.28,17.14 | C15.1 v3.01,22.22 | v2.38,27.93 C23.1 | IC12.2 v6.18,27.3 | IC1.28 v13.81,20.95 | v9.36,17.14 9.36,18.8 C6.2 | IC2.4 v8.73,5.71 C16.1 | R9.1 15.08,28.57 v16.34,28.57 | C11.1 v11.9,31.74 | C18.1 15.08,30.08 v15.08,31.11 | v13.17,25.39 12.29,25.39 C2.2
  Top 0.406: R12.2 19.52,40.64 v16.34,37.46
  Top 1.778: K1.C 21.42,61.59 38.57,61.59 41.74,64.77 51.27,64.77 Q1.3
  pour Bottom (rank 2): 2.38,0.63 18.88,0.63 19.52,1.27 19.52,17.77 16.98,17.77 16.98,32.38 12.54,32.38 12.54,38.1 1.1,38.1 1.1,1.9
  pour Bottom (isolate 1.27, no thermals): 15.71,66.67 29.68,66.67 37.3,59.05 37.3,40 36.03,38.73 14.44,38.73 14.44,40.64 18.25,44.45 18.25,57.78 14.44,61.59 14.44,65.4
  pour Bottom (isolate 0.813): 12.54,38.1 16.98,38.1 16.98,32.38 12.54,32.38
GNDIO  (via drill 0.3)
  Top 0.254: DC4.1 81.75,31.74 IC8.9 83.66,31.74 C9.1 | 95.88,28.81 C19.1 92.5,28.85 X2.B1 | 95.88,28.81 C8.1 | IC3.2.1 IC3.2 96.36,28.81 95.88,28.81 | v86.83,73.02 IC10.3 82.78,73.02 C5.2 | v88.1,75.56 IC10.8 | v88.1,74.29 IC10.7 | v80.48,62.86 80.48,64.07 I2C.5 | C27.- v80.48,23.49 | v42.38,58.41 41.26,58.41 Q3.E | OK6.3 v79.84,55.88
  Bottom 0.254: v42.38,58.41 42.38,73.66 44.92,75.56 79.21,75.56
  pour Bottom: 78.58,76.83 98.26,76.83 99.53,75.56 99.53,17.14 78.58,17.14
N$1
  Top 0.254: 47.59,52.07 48.73,52.07 49.37,52.7 49.37,54.61 48.73,55.24 47.46,55.24 46.19,56.51 Q1.1 | 47.59,52.07 IC6.6 | 47.59,50.8 47.59,52.07
N$2
  Top 1.778: Q1.2 45.55,71.75 45.55,69.21
  Top 2.54: 10.63,67.94 12.54,67.94 13.81,69.21 34.12,69.21 K1.NO
  Top 3.81: BATTERIE+.A1 10.63,67.94 | 45.55,69.21 37.3,69.21 36.66,68.57 K1.NO
  Bottom 2.54: K1.NO 34.12,69.21 3.01,69.21
  pour Bottom (isolate 1.016, no thermals): 10.63,67.94 10.63,76.83 37.94,77.46 39.2,76.19 39.2,66.03 37.3,64.13 34.76,64.13 30.95,67.94
  pour Bottom (no thermals): 12.54,66.03 0.47,66.03 0.47,75.56 10.63,75.56 11.9,73.02 15.71,69.21
  pour Top (isolate 1.016, no thermals): 0.47,66.03 0.47,77.46 39.2,77.46 39.2,66.03 37.3,64.13 34.76,64.13 30.95,67.94 14.44,67.94 12.54,66.03
  pour Top (no thermals): 13.17,66.67 12.54,66.03 0.47,66.03 0.47,77.46 13.17,77.46
N$3
  Top 0.254: IC9.1 Q4.2
N$4  (via drill 0.3)
  Top 0.254: IC1.3 30.17,18.55 30.31,18.41 v37.3,18.41 | v37.3,13.33 57.62,13.33 58.25,12.7 62.06,12.7 CON2.7 65.24,15.87 R29.2
  Bottom 0.254: v37.3,18.41 v37.3,13.33
N$5
  Top 0.254: 7.13,26.66 7.13,26.03 R3.1 | 7.13,26.66 IC12.3 | C18.2 12.86,29.29 R9.2 11.59,26.66 7.13,26.66
N$6
  Top 0.254: 4.59,33.65 C29.2 | 4.59,33.65 R5.2 | 7.13,33.65 R2.1 | IC12.4 7.13,33.65 | 7.13,33.65 4.59,33.65
N$7  (via drill 0.3)
  Top 0.254: R5.1 2.77,35.55 C29.1 2.77,32.38 v3.64,32.38 | 3.64,28.53 R8.1 | IC12.1 3.64,28.53 | 3.64,28.53 v3.64,28.57
  Bottom 0.254: v3.64,28.57 v3.64,32.38
N$8  (via drill 0.3)
  Top 0.254: v51.27,4.44 61.43,4.44 CON2.1 64.29,7.3 R27.2 | IC1.1 27.96,16.95 29.04,15.87 v51.27,15.87
  Bottom 0.254: v51.27,15.87 v51.27,4.44
N$9  (via drill 0.3)
  Top 0.254: v96.99,48.26 84.44,48.26 Q5.E
  Bottom 0.254: DC2.2 96.99,17.77 v96.99,48.26
N$10  (via drill 0.3)
  Top 0.254: v27.77,3.17 v65.24,3.17 67.14,3.17 R25.2 | IC1.44 24.79,15.24 v27.77,15.24
  Bottom 0.254: CON2.3 65.24,6.98 v65.24,3.17 | v27.77,3.17 v27.77,15.24
N$11  (via drill 0.3)
  Top 0.254: v13.17,15.24 16.79,15.24 IC1.34 | R8.2 3.64,24.76 10.39,24.76 C2.1 12.29,22.86 v13.17,22.86
  Bottom 0.254: v13.17,22.86 v13.17,15.24
N$12
  Top 0.254: C3.2 Q2.2 31.58,21.58 31.42,21.75 IC1.7
N$13  (via drill 0.3)
  Top 0.254: Q2.1 C4.2 | IC1.8 30.01,22.55 30.31,22.86 v32.22,22.86
  Bottom 0.254: v32.22,22.86 33.49,22.86 34.12,23.49 Q2.1
N$14  (via drill 0.3)
  Top 0.254: I2C.6 82.7,65.4 R10.1 v83.66,67.94 | v83.02,71.75 IC10.4
  Bottom 0.254: v83.02,71.75 83.66,71.11 v83.66,67.94
N$15
  Top 0.254: I2C.7 81.75,66.67 82.06,66.98 R11.1 85.56,69.84 87.47,71.75 IC10.5
N$16
  Top 0.406: R12.1 6.82,40.64 R2.2 | UMRICHTER+.A1 11.27,47.62 D7.C
  Bottom 2.54: R12.1 3.64,47.62 UMRICHTER+.A1
  Bottom 3.81: UMRICHTER+.A1 3.01,47.62
  pour Bottom (no thermals): 0.47,49.53 13.81,49.53 13.81,43.18 12.54,41.91 12.54,38.73 0.47,38.73
N$17
  Top 0.254: IC10.2 80.8,74.29 R23.2
N$18
  Top 0.254: UMRICHTER-.A1 5.55,53.97
  Top 0.406: 9.36,53.97 9.36,55.88 D7.A R30.2
  Top 2.54: UMRICHTER-.A1 BATTERIE-.A1
  Top 3.81: BATTERIE-.A1 10.63,61.59 | 5.55,53.97 9.36,53.97 10.63,53.97
  Bottom 2.54: UMRICHTER-.A1 3.01,53.97 3.01,61.59
  Bottom 3.81: BATTERIE-.A1 10.63,61.59 | UMRICHTER-.A1 10.63,53.97
  pour Bottom (no thermals): 0.47,63.5 12.54,63.5 12.54,59.69 14.44,57.78 14.44,52.07 0.47,52.07
  pour Top (no thermals): 0.47,63.5 12.54,63.5 12.54,59.69 14.44,57.78 14.44,52.07 0.47,52.07
N$19  (via drill 0.3)
  Top 0.254: R21.2 9.36,27.93 v10.63,27.93 | R4.1 10.95,12.7 | IC1.37 19.19,13.64 18.25,12.7 10.95,12.7 | 10.95,12.7 10.63,12.7 v10.63,14.6
  Bottom 0.254: v10.63,14.6 v10.63,27.93
N$20
  Top 0.254: OK2.3 40.48,55.73 Q3.B
N$21
  Top 0.254: OK2.1 39.2,44.45 39.84,43.81 R15.2
N$22
  Top 0.254: IC2.3 IC2.2 8.96,8.25 C16.2 7.46,8.49 7.46,17.14 7.85,17.54 C6.1 | 6.31,19.04 arc-90 L1.2 7.85,19.68 C6.1 | IC1.27 7.85,21.75 C6.1
N$23  (via drill 0.3)
  Top 0.254: I2C.2 v72.22,66.67 R13.1 | IC1.20 18.39,32.52 23.33,37.46 v41.74,37.46 | v56.98,53.97 v72.22,53.97 | v41.74,39.37 IC9.5 | v41.74,46.98 56.35,46.98 v56.98,47.62
  Bottom 0.254: v72.22,53.97 v72.22,66.67 | v56.98,47.62 v56.98,53.97 | v41.74,37.46 v41.74,39.37 v41.74,46.98
N$24  (via drill 0.3)
  Top 0.254: I2C.3 v69.69,65.4 R14.1 | IC1.19 19.19,32.05 23.33,36.19 v43.02,36.19 | v58.25,52.7 v69.69,52.7 | v43.02,38.1 IC9.6 | v43.02,45.72 v56.98,45.72
  Bottom 0.254: v69.69,52.7 v69.69,65.4 | v56.98,45.72 58.25,46.98 v58.25,52.7 | v43.02,36.19 v43.02,38.1 v43.02,45.72
N$25  (via drill 0.3)
  Top 0.254: IC1.41 22.39,13 27.14,8.25 v39.84,8.25 | v39.84,38.73 R15.1
  Bottom 0.254: v39.84,8.25 v39.84,38.73
N$26  (via drill 0.3)
  Top 0.254: K1.1 34.59,53.17 D2.C 37.94,52.07 v41.74,52.07 | D3.A 90,28.57 90,34.93 X2.B2
  Bottom 0.254: X2.B2 87.53,34.92 88.73,34.92 90,36.19 90,76.19 44.28,76.19 41.74,73.66 v41.74,52.07
N$27
  Top 0.254: IC1.15 22.39,30.17 24.6,32.38 R17.1
N$28
  Top 0.254: K1.2 26.04,54.77 D2.A 39.2,54.77 | 39.2,54.77 OK2.4 | 39.2,54.77 39.2,56.68 arc90 Q3.C
N$29  (via drill 0.3)
  Top 0.254: IC1.9 28.9,23.35 29.68,24.12 v63.97,24.12 | v63.97,38.1 IC8.3
  Bottom 0.254: v63.97,24.12 v63.97,38.1
N$30
  Top 0.254: R6.2 65.24,18.41 CON2.9 61.43,18.41 58.25,18.41 56.98,17.14 29.68,17.14 29.07,17.75 IC1.2
N$31  (via drill 0.3)
  Top 0.254: v48.73,10.79 25.87,10.79 23.19,13.47 IC1.42 | v50.63,31.74 50.63,33.02 R1.2
  Bottom 0.254: v48.73,10.79 49.37,11.43 49.37,30.47 v50.63,31.74
N$32
  Top 0.254: R6.1 74.13,18.41 74.13,6.34 IC11.6
N$33
  Top 0.254: R28.1 82.06,58.41 82.7,57.78 83.58,57.78 T2.2
  Top 0.406: X3.B1 84.83,56.53 T2.2 84.59,53.97 D5.A
N$34  (via drill 0.3)
  Top 0.254: IC1.10 27.8,24.15 29.04,25.39 v56.35,25.39 | v56.35,33.65 56.98,34.29 IC8.6
  Bottom 0.254: v56.35,25.39 v56.35,33.65
N$35  (via drill 0.3)
  Top 0.254: IC11.12 v83.15,7.62
  Bottom 0.254: v83.15,7.62 CON1.2
N$36
  Top 0.254: IC8.13 83.44,36.83 R24.2 86.55,39.94 X2.B4
N$37
  Top 0.254: IC1.16 21.59,30.64 25.23,34.29 R22.1
N$38
  Top 0.254: IC8.12 83.44,35.55 R24.1 83.87,35.55 84.92,35.55 86.81,37.44 X2.B3
N$39  (via drill 0.3)
  Top 0.254: IC8.4 IC8.5 56.35,35.55 v54.45,33.65 | IC1.43 23.99,13.94 25.87,12.06 v54.45,12.06
  Bottom 0.254: v54.45,12.06 54.45,17.14 55.08,17.77 55.08,22.86 54.45,23.49 v54.45,33.65
N$40  (via drill 0.3)
  Top 0.254: IC1.14 23.19,29.7 23.96,30.47 v51.27,30.47 | IC8.7 71.59,33.02 v66.51,33.02 | v51.27,22.86 v62.7,22.86
  Bottom 0.254: v51.27,30.47 v51.27,22.86 | v66.51,33.02 66.51,22.86 v62.7,22.86
N$41
  Top 0.254: X5.B2 95.08,66.03 95.72,66.67 95.72,69.21 92.55,72.38 80.16,72.38 R23.1
N$42
  Top 0.254: R33.2 15.08,40.64 15.71,41.27 R30.1
N$43
  Top 0.406: X3.B2 83.86,59.03 T2.1
N$44  (via drill 0.3)  (1 unrouted)
  Top 0.254: IC11.15 v81.75,11.43 83.02,11.43 C30.1 83.26,11.43 93.18,11.43 95.08,9.52 | IC11.9 v81.75,3.8
  Bottom 0.254: v81.75,3.8 v81.75,11.43
N$45
  Top 0.254: Q5.B 81.18,47.79 OK3.3
N$46  (via drill 0.3)
  Top 0.254: v71.59,51.43 OK3.1 | v71.59,45.72 67.78,41.91 R20.2
  Bottom 0.254: v71.59,45.72 v71.59,51.43
N$47  (via drill 0.3)
  Top 0.254: IC1.13 23.99,29.23 24.6,29.84 v59.52,29.84 | v59.52,41.91 R20.1
  Bottom 0.254: v59.52,29.84 v59.52,41.91
N$48  (via drill 0.3)
  Top 0.254: IC1.11 26.59,26.75 27.77,27.93 v58.25,27.93 | OK4.4 72.22,43.81 69.05,40.64 v58.25,40.64
  Bottom 0.254: v58.25,27.93 v58.25,40.64
N$49
  Top 0.254: X4.B2 86.22,47.01 85.56,46.35 81.75,46.35 81.18,45.78 OK4.2
N$50
  Top 0.254: OK4.1 82.03,42.96 R19.2
N$51
  Top 0.254: IC9.3 52.54,38.1 60.16,46.98 G1.+
N$52
  Top 0.254: IC11.11 84.29,6.34 84.29,5.71 | 84.29,5.71 87.47,5.71 CON1.3 | 84.29,5.71 84.29,1.9 R26.1
N$53
  Top 0.254: IC11.13 84.29,8.89 CON1.4
N$54  (via drill 0.3)
  Top 0.254: IC1.4 33.82,19.35 v34.12,19.68 | v34.12,9.52 57.62,9.52 58.25,10.16 62.06,10.16 CON2.5
  Bottom 0.254: v34.12,9.52 v34.12,19.68
N$55
  Top 0.254: IC11.14 83.66,10.16 84.29,10.79 87.47,10.79 CON1.5
N$57
  Top 0.254: R17.2 LED1.A
N$58
  Top 0.254: X4.B1 83.81,44.51 arc-90 R19.1
N$59  (via drill 0.3)
  Top 0.254: C15.2 6.82,22.46 R3.2 6.82,23.49 v9.36,23.49 | v9.36,20.31 10.63,20.31 10.79,20.15 IC1.29 16.34,20.15 16.34,16.5 | IC1.35 17.59,16.5 16.34,16.5 | IC2.6 13.81,6.98 13.81,11.43 v15.08,11.43 | v15.08,15.87 15.71,15.87 16.34,16.5
  Bottom 0.254: v9.36,20.31 v9.36,23.49 | v15.08,11.43 v15.08,15.87
N$60  (via drill 0.3)
  Top 0.254: IC1.12 24.79,28.76 25.23,29.2 v47.46,29.2 | v47.46,36.83 IC9.7
  Bottom 0.254: v47.46,29.2 v47.46,36.83
N$61  (via drill 0.3)
  Top 0.254: D4.C arc-90 82.86,5.08 IC11.10 v77.94,5.08 | v77.94,12.7 IC11.16 82.78,12.7 C30.2 83.02,12.7 v86.19,12.7
  Bottom 0.254: v77.94,5.08 v77.94,12.7 | v86.19,12.7 CON1.6
N$62  (via drill 0.3)
  Top 0.254: 66.11,26.35 C20.2 66.11,20.31 v56.35,20.31 C34.+ | IC4.3 2.78,7.84 3.01,7.62 C17.2 4.04,7.22 8.73,1.9 v56.35,1.9
  Top 0.406: 66.11,28.49 IC5.3 | C20.2 66.11,28.49 | 66.11,28.49 68.34,28.49 D1.1
  Bottom 0.254: v56.35,1.9 v56.35,20.31
N$63
  Top 0.254: IC9.2 53.17,36.83 Q4.1
N$64
  Top 0.254: R22.2 LED2.A
N$65  (via drill 0.3)
  Top 0.254: v50,50.8 IC6.2 | R34.2 R1.1 48.73,33.44 v48.73,34.29
  Bottom 0.254: v48.73,34.29 48.73,40.64 50,41.91 v50,50.8
N$66
  Top 0.406: DC4.4 72.69,29.2 D1.3
N$67  (via drill 0.3)
  Top 0.254: 9.12,29.76 9.04,29.84 v11.9,29.84 | v11.9,17.14 11.9,13.97 18.39,13.97 IC1.36 | 9.12,29.76 C11.2 9.12,34.16 R33.1 | 9.12,29.76 R21.1
  Bottom 0.254: v11.9,17.14 v11.9,29.84
N$69
  Top 0.254: D6.C R26.2
N$70
  Top 0.254: IC11.5 69.05,7.62 68.41,6.98 68.41,5.71 67.46,4.75 R25.1
N$71
  Top 0.254: IC11.4 68.09,8.89 R27.1
N$72
  Top 0.254: R29.1 72.86,15.87 72.86,10.16 IC11.3
N$73
  Top 0.254: R28.2 80.16,57.15 OK6.4 82.28,57.15 T2.3
N$74  (via drill 0.3)
  Top 0.254: v67.78,57.15 OK6.1 | R32.2 v67.78,44.45
  Bottom 0.254: v67.78,44.45 v67.78,57.15
N$76  (via drill 0.3)
  Top 0.254: v60.8,44.45 R32.1 | IC1.40 21.59,12.53 27.14,6.98 v58.89,6.98
  Bottom 0.254: v58.89,6.98 58.89,22.86 60.8,24.76 v60.8,44.45
VCC  (via drill 0.3)
  Top 0.254: 55.08,51.43 C32.1 68.02,51.19 v69.05,50.16 | D1.2 69.05,25.88 v69.05,24.76 | v44.92,49.53 IC6.8
  Bottom 0.254: v69.05,24.76 v69.05,50.16 | C25.+ v44.92,49.53
  pour Top: 44.92,56.51 55.08,56.51 55.08,48.26 44.28,48.26 43.65,48.89 43.65,55.24
VCCINT  (via drill 0.3)
  Top 0.254: DC4.2 79.21,51.43 v79.84,52.07 80.48,51.43 OK3.4 83.02,51.43 | 83.02,51.43 Q5.C | X4.B4 83.59,52.01 83.02,51.43
  Top 0.406: DC4.2 79.21,27.93 C24.+ | D5.C 79.84,53.97 v79.84,52.07 | D3.C 86.19,28.44 C24.+ | C24.+ C19.2 94.54,27.06 IC3.3
VCCIO
  pour Top: 78.58,76.83 98.26,76.83 99.53,75.56 99.53,17.14 78.58,17.14
VDD
  Top 0.254: IC4.1 IC4.1 arc90 5.88,13.33 | C7.2 arc-90 5.55,16.11
  pour Top: 1.1,38.1 12.54,38.1 12.54,32.38 17.61,32.38 17.61,17.77 19.52,17.77 19.52,1.27 18.88,0.63 2.38,0.63 1.1,1.9

### Text on the board
Bottom: Markus Walser
Document: Batterie + | OW | Batterie - | Umrichter - | Notaus | Umrichter + | Startbox | RS485 | ISP | Energex 2011 | Supervisor | Mediator Rev 1.1